# Altium schematic sheet BlancerCarMotoDriver.SchDoc
size A4
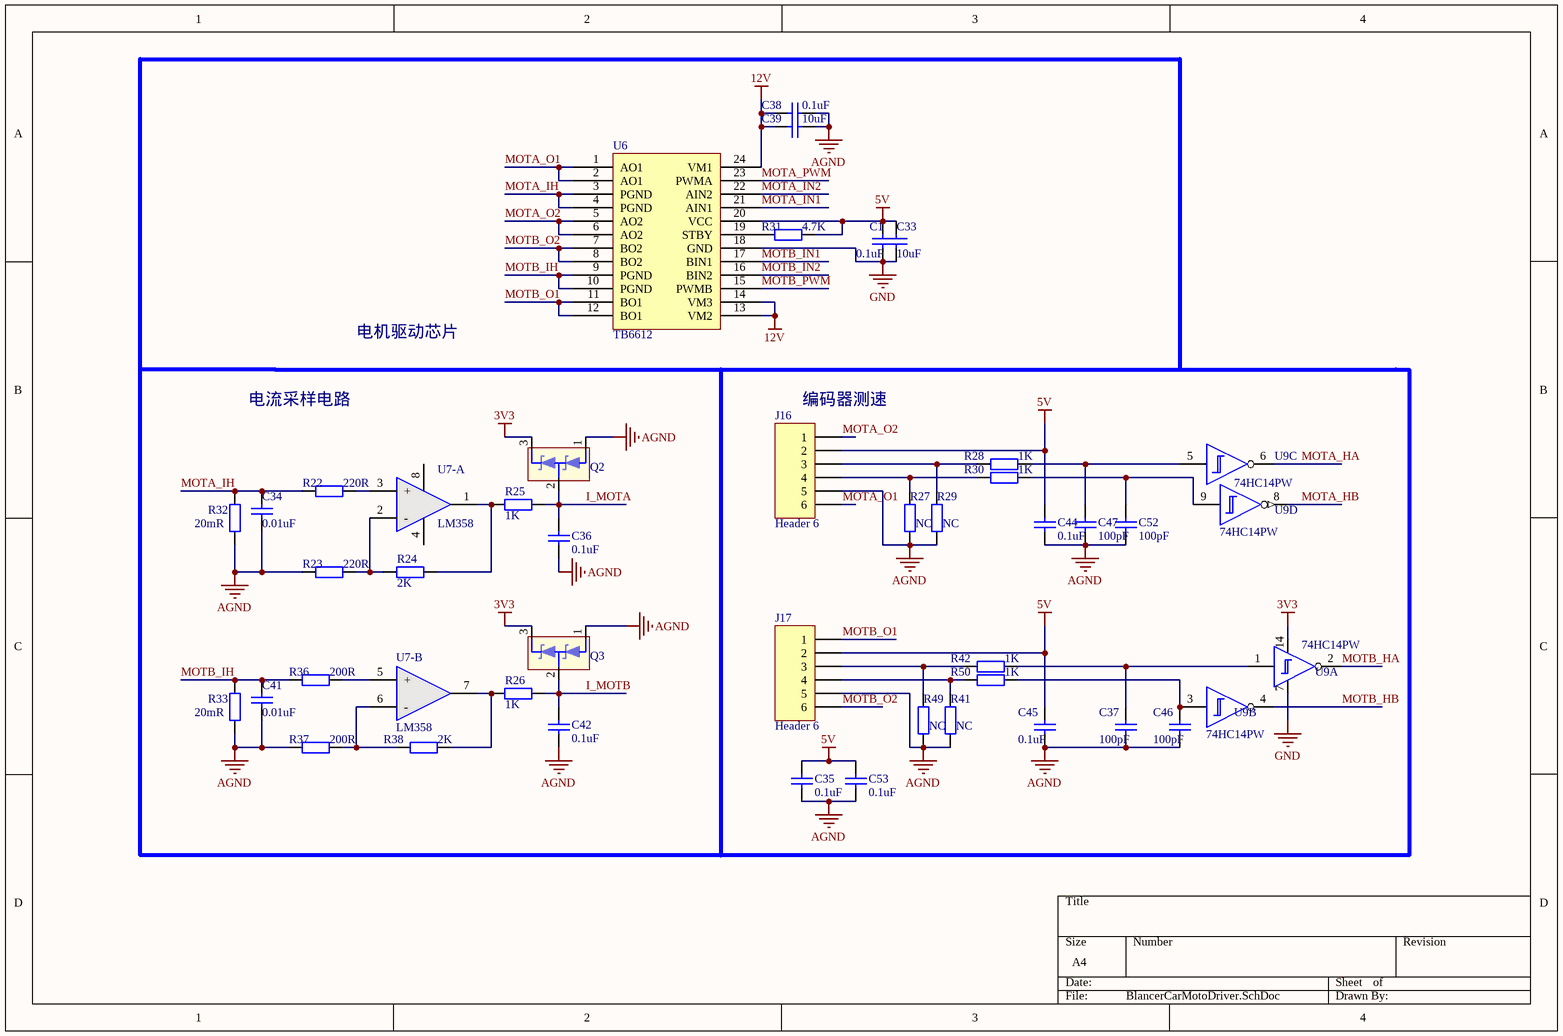
[diagram p0: BlancerCarMotoDriver.SchDoc]

## Parts
C1  value 0.1uF  [0805-1]  (hidden comment: Cap)
C33  value 10uF  [0805-1]  (hidden comment: Cap)
C34  value 0.01uF  [0805-1]  (hidden comment: Cap)
C35  value 0.1uF  [0805-1]  (hidden comment: Cap)
C36  value 0.1uF  [0805-1]  (hidden comment: Cap)
C37  value 100pF  [0805-1]  (hidden comment: Cap)
C38  value 0.1uF  [0805-1]  (hidden comment: Cap)
C39  value 10uF  [0805-1]  (hidden comment: Cap)
C41  value 0.01uF  [0805-1]  (hidden comment: Cap)
C42  value 0.1uF  [0805-1]  (hidden comment: Cap)
C44  value 0.1uF  [0805-1]  (hidden comment: Cap)
C45  value 0.1uF  [0805-1]  (hidden comment: Cap)
C46  value 100pF  [0805-1]  (hidden comment: Cap)
C47  value 100pF  [0805-1]  (hidden comment: Cap)
C52  value 100pF  [0805-1]  (hidden comment: Cap)
C53  value 0.1uF  [0805-1]  (hidden comment: Cap)
J16  Header 6  [HDR1X6]
J17  Header 6  [HDR1X6]
Q2  肖基特二极管  [BAT54S(SOT-23-3)]  (value not drawn)
Q3  肖基特二极管  [BAT54S(SOT-23-3)]  (value not drawn)
R22  value 220R  [0805-1]  (hidden comment: Res1)
R23  value 220R  [0805-1]  (hidden comment: Res1)
R24  value 2K  [0805-1]  (hidden comment: Res1)
R25  value 1K  [0805-1]  (hidden comment: Res1)
R26  value 1K  [0805-1]  (hidden comment: Res1)
R27  value NC  [0805-1]  (hidden comment: Res1)
R28  value 1K  [0805-1]  (hidden comment: Res1)
R29  value NC  [0805-1]  (hidden comment: Res1)
R30  value 1K  [0805-1]  (hidden comment: Res1)
R31  value 4.7K  [0805-1]  (hidden comment: Res1)
R32  value 20mR  [0805-1]  (hidden comment: Res1)
R33  value 20mR  [0805-1]  (hidden comment: Res1)
R36  value 200R  [0805-1]  (hidden comment: Res1)
R37  value 200R  [0805-1]  (hidden comment: Res1)
R38  value 2K  [0805-1]  (hidden comment: Res1)
R41  value NC  [0805-1]  (hidden comment: Res1)
R42  value 1K  [0805-1]  (hidden comment: Res1)
R49  value NC  [0805-1]  (hidden comment: Res1)
R50  value 1K  [0805-1]  (hidden comment: Res1)
U6  TB6612  [TB6612]
U7-  LM358  [NSO8_N]  (parts A,B of 2)
U9  74HC14PW  [SSOP-14]  (parts A,B,C,D of 6)

## Nets
3V3: Q2.3 Q3.3 U9.14(VCC)
5V: C1.2 C33.2 C35.2 C44.2 C45.2 C53.2 J16.2 J17.2 R31.2 U6.20(VCC)
12V: C38.1 C39.1 U6.13(VM2) U6.14(VM3) U6.24(VM1)
AGND: C34.1 C35.1 C36.1 C37.1 C38.2 C39.2 C41.1 C42.1 C44.1 C45.1 C46.1 C47.1 C52.1 C53.1 J16.5 J17.5 Q2.1 Q3.1 R23.1 R27.1 R29.1 R32.1 R33.1 R37.2 R41.1 R49.1
GND: C1.1 C33.1 U6.18(GND) U9.7
I_MOTA: C36.2 Q2.2 R25.2
I_MOTB: C42.2 Q3.2 R26.1
MOTA_HA: U9.6(Y)
MOTA_HB: U9.8(Y)
MOTA_IH: C34.2 R22.1 R32.2 U6.3(PGND) U6.4(PGND)
MOTA_IN1: U6.21(AIN1)
MOTA_IN2: U6.22(AIN2)
MOTA_O1: J16.6 U6.1(AO1) U6.2(AO1)
MOTA_O2: J16.1 U6.5(AO2) U6.6(AO2)
MOTA_PWM: U6.23(PWMA)
MOTB_HA: U9.2(Y)
MOTB_HB: U9.4(Y)
MOTB_IH: C41.2 R33.2 R36.2 U6.9(PGND) U6.10(PGND)
MOTB_IN1: U6.17(BIN1)
MOTB_IN2: U6.16(BIN2)
MOTB_O1: J17.1 U6.11(BO1) U6.12(BO1)
MOTB_O2: J17.6 U6.7(BO2) U6.8(BO2)
MOTB_PWM: U6.15(PWMB)
NetC37_2: C37.2 R42.2 U9.1(A)
NetC46_2: C46.2 R50.2 U9.3(A)
NetC47_2: C47.2 R28.2 U9.5(A)
NetC52_2: C52.2 R30.2 U9.9(A)
NetJ16_3: J16.3 R28.1 R29.2
NetJ16_4: J16.4 R27.2 R30.1
NetJ17_3: J17.3 R42.1 R49.2
NetJ17_4: J17.4 R41.2 R50.1
NetR22_2: R22.2 U7-.3(+)
NetR23_2: R23.2 R24.1 U7-.2(-)
NetR24_2: R24.2 R25.1 U7-.1(OUT1)
NetR26_2: R26.2 R38.1 U7-.7(OUT2)
NetR31_1: R31.1 U6.19(STBY)
NetR36_1: R36.1 U7-.5(+)
NetR37_1: R37.1 R38.2 U7-.6(-)

Not connected (* = marked no-connect by the designer): U7- 4(V-) 8(V+)

## Notes on the sheet
- 电机驱动芯片
- 电流采样电路
- (near J16) 编码器测速

## Library data of the parts
C1 C33-C39 C41 C42 C44-C47 C52 C53 = Cap: Capacitor; Published: 8-Jun-2000; LatestRevisionDate: 17-Jul-2002; LatestRevisionNote: Re-released for DXP Platform.; PackageReference: RAD-0.3; Publisher: Altium Limited
J16 J17 = Header 6: Header, 6-Pin; LatestRevisionDate: 17-Jul-2002; LatestRevisionNote: Re-released for DXP Platform.; Publisher: Altium Limited
Q2 Q3 = BAT54S
R22-R33 R36-R38 R41 R42 R49 R50 = Res1: 贴片电阻; Published: 8-Jun-2000; LatestRevisionDate: 17-Jul-2002; LatestRevisionNote: Re-released for DXP Platform.; PackageReference: AXIAL-0.4; Publisher: Altium Limited
U7- = LM358: 双运放
U9 = 74HC14PW: 6非门